# Altium schematic sheet Sheet1.SchDoc
size A; SheetNumber: 1; SheetTotal: 1
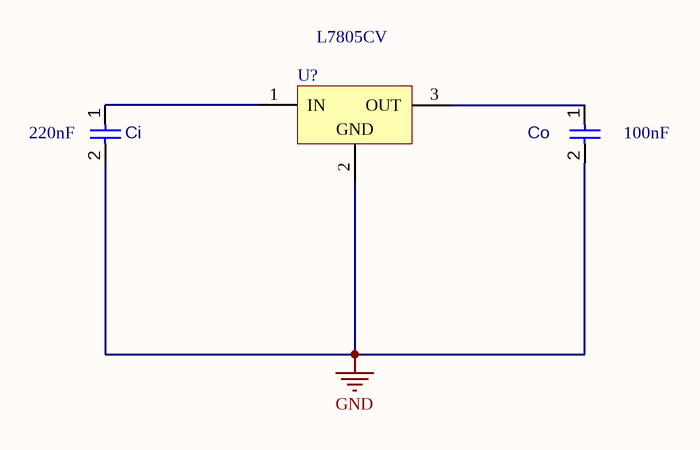
[diagram p0: Sheet1.SchDoc]

## Parts
Ci  value 220nF  [CAPC0402(1005)60_L]  (hidden comment: Capacitor 220nF +/-20% 10V 0402)
Co  value 100nF  [CAPC1005X56X25LL10T15]  (hidden comment: Capacitor 0.1 uF +/- 5% 16 V 0402)
U?  L7805CV  [TO220]

## Nets
GND: Ci.2 Co.2 U?.2(GND)
NetCi_1: Ci.1 U?.1(IN)
NetCo_1: Co.1 U?.3(OUT)

## Library data of the parts
Ci = CMP-001-00057-3: Chip Capacitor, 220nF +/-20%, 10V, 0402, Thickness 0.6 mm; Tolerance: 10%; Max Operating Temperature: 85°C; Pins: 2; Case/Package: 0402; Mounting Technology: SMT; Voltage Rating: 10V; Min Operating Temperature: -55°C
Co = CMP-001-00001-6: Chip Capacitor, 0.1 uF, +/- 5%, 16 V, 0402 (1005 Metric); Capacitor Type: Ceramic; Voltage Rating: 16V; Max Operating Temperature: 125°C; Min Operating Temperature: -55°C; Case/Package: 0402; Mounting Technology: SM; Pins: 2; Tolerance: 5%; RoHS Compliant: True
U? = CMP-019-00018-3: Positive Voltage Regulator IC, 1.5 A, 5 V, 0 to 125 degC, 3-Pin TO-220, RoHS, Tube; Manufacturer: STMicroelectronics; Max Input Voltage: 35V; Min Supply Voltage: 8V; Nominal Output Voltage: 5V; Outputs: 1; Output Current: 1.5A; Dropout Voltage: 2V; Max Supply Voltage: 20V; Min Input Voltage: 7V; Datasheet Version: Rev 30, 09/2012; Min Operating Temperature: 0°C; Manufacturer URL: http://www.st.com/; Pins: 3; Mounting Technology: TH; Output Voltage: 5V; RoHS Compliant: True; Max Ouput Current: 1.5A; Datasheet URL: https://datasheet.ciiva.com/15111/getdatasheetpartid-44136-15111027.pdf; Packaging: Rail/Tube; Max Operating Temperature: 125°C; Case/Package: TO-220; Package Quantity: 50